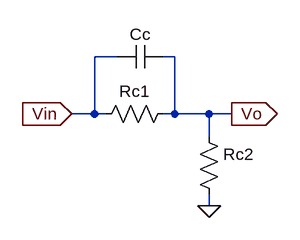
[diagram p0: schematic Lab_3_Circ_3-Red compensador.asc]
Lab_3_Circ_3-Red compensador.asc, the LTspice schematic file:
Version 4
SHEET 1 1652 680
WIRE 576 -320 544 -320
WIRE 656 -320 640 -320
WIRE 544 -240 544 -320
WIRE 544 -240 512 -240
WIRE 560 -240 544 -240
WIRE 656 -240 656 -320
WIRE 656 -240 640 -240
WIRE 704 -240 656 -240
WIRE 736 -240 704 -240
WIRE 704 -208 704 -240
WIRE 704 -112 704 -128
FLAG 704 -112 0
FLAG 512 -240 Vin
IOPIN 512 -240 In
FLAG 736 -240 Vo
IOPIN 736 -240 Out
SYMBOL res 656 -256 R90
WINDOW 0 0 56 VBottom 2
WINDOW 3 32 56 VTop 2
SYMATTR InstName Rc1
SYMATTR Value ""
SYMBOL res 688 -224 R0
SYMATTR InstName Rc2
SYMATTR Value ""
SYMBOL cap 640 -336 R90
WINDOW 0 0 32 VBottom 2
WINDOW 3 32 32 VTop 2
SYMATTR InstName Cc
SYMATTR Value ""

The netlist it stands for:
* Lab_3_Circ_3-Red compensador.asc
Rc1 Vo Vin
Rc2 Vo 0
Cc Vo Vin
.backanno
.end